# Altium schematic sheet STM32_MCU.SchDoc
size A3; SheetNumber: 7; SheetTotal: 16
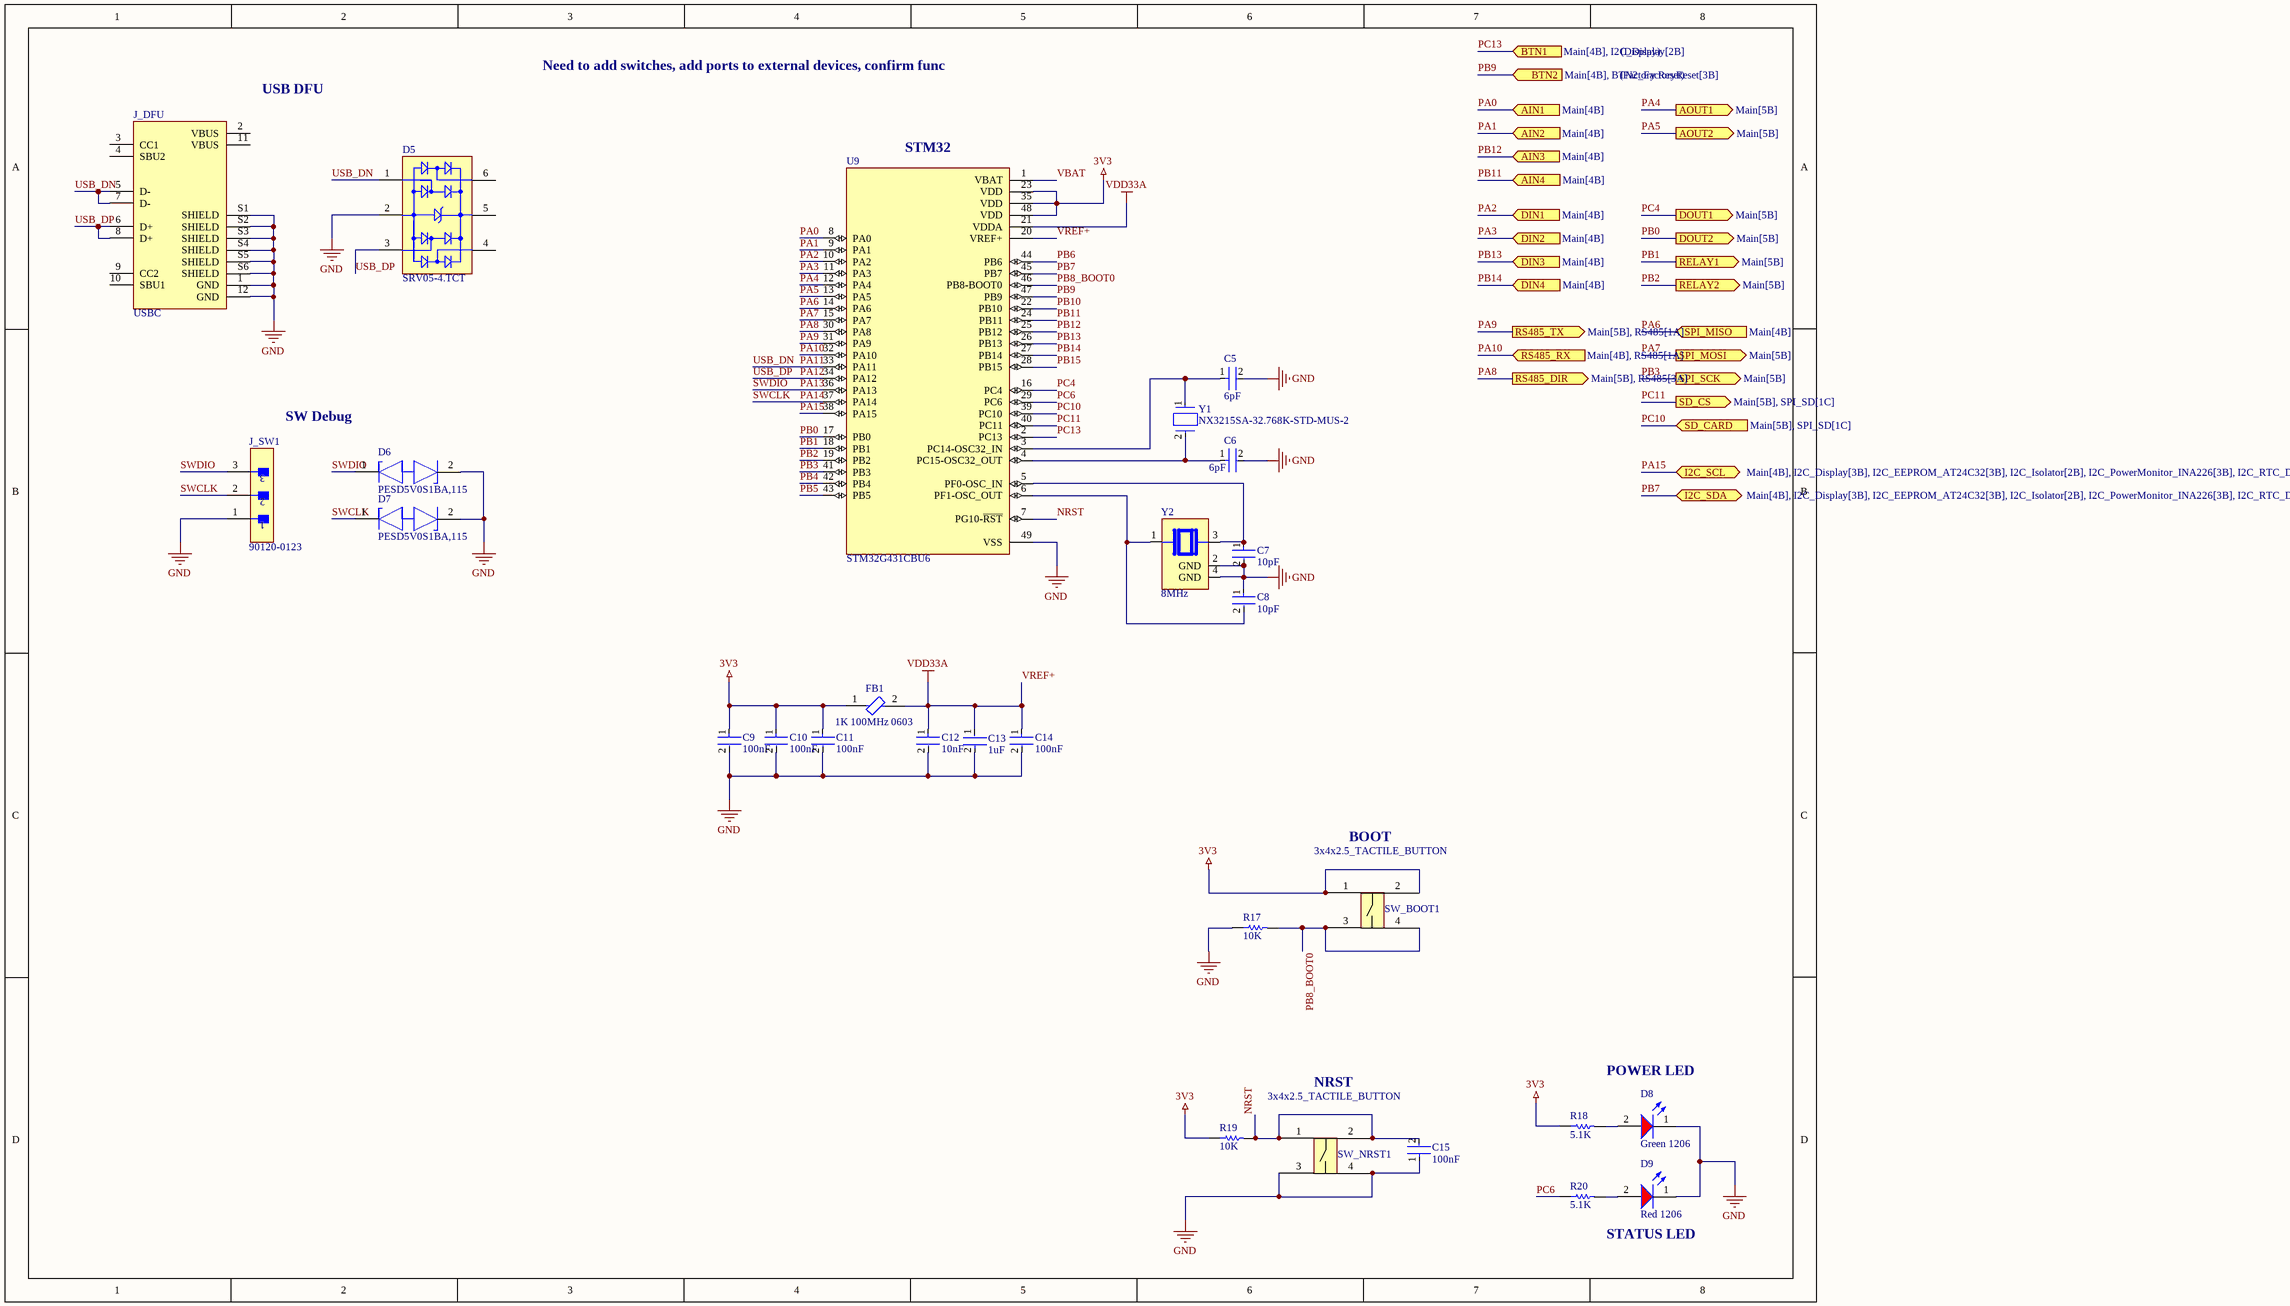
[diagram p0: STM32_MCU.SchDoc]

## Parts
C5  6pF  [FP-CGA3E-0_3-0_1-MFG]
C6  6pF  [FP-CGA3E-0_3-0_1-MFG]
C7  10pF  [FP-C0603C-CF-MFG]
C8  10pF  [FP-C0603C-CF-MFG]
C9  100nF  [FP-CGA3E-0_3-0_1-IPC_A]
C10  100nF  [FP-CGA3E-0_3-0_1-IPC_A]
C11  100nF  [FP-CGA3E-0_3-0_1-IPC_A]
C12  10nF  [FP-CC0603-DA-MFG]
C13  1uF  [FP-C1608-080-0_1-IPC_B]
C14  100nF  [FP-CGA3E-0_3-0_1-IPC_A]
C15  100nF  [FP-CGA3E-0_3-0_1-IPC_A]
D5  SRV05-4.TCT  [SMTC-SOT23-6_V]
D6  PESD5V0S1BA,115  [FP-SOD323-CA-MFG]
D7  PESD5V0S1BA,115  [FP-SOD323-CA-MFG]
D8  Green 1206  [WL-SMCW_1206_150120xx75000]
D9  Red 1206  [WL-SMCW_1206_150120xx75000]
FB1  1K 100MHz 0603  [FP-BLM18-0_15-t0_8-MFG]
J_DFU  USBC  [JAE_DX07S016JA1R1500]
J_SW1  90120-0123  [FP-90120-0123-MFG]
R17  10K  [RESC1609X55X30LL15T15]
R18  5.1K  [RESC1608X55X30LL15T15]
R19  10K  [RESC1609X55X30LL15T15]
R20  5.1K  [RESC1608X55X30LL15T15]
SW_BOOT1  3x4x2.5_TACTILE_BUTTON  [3x4x2.5_TACTILE_BUTTON]
SW_NRST1  3x4x2.5_TACTILE_BUTTON  [3x4x2.5_TACTILE_BUTTON]
U9  STM32G431CBU6  [QFN50P700X700X60-49N]
Y1  NX3215SA-32.768K-STD-MUS-2  [FP-NX3215SA-MFG]
Y2  8MHz  [XTAL_C3E-8.000-10-1020-M]

## Ports
AIN1 (in, see Main[4B]), AIN2 (in, see Main[4B]), AIN3 (in, see Main[4B]), AIN4 (in, see Main[4B]), AOUT1 (out, see Main[5B]), AOUT2 (out, see Main[5B]), BTN1 (in, see Main[4B], I2C_Display[2B]), BTN2 (in, see Main[4B], BTN2_FactoryReset[3B]), DIN1 (in, see Main[4B]), DIN2 (in, see Main[4B]), DIN3 (in, see Main[4B]), DIN4 (in, see Main[4B]), DOUT1 (out, see Main[5B]), DOUT2 (out, see Main[5B]), I2C_SCL (bidir, see Main[4B], I2C_Display[3B], I2C_EEPROM_AT24C32[3B], I2C_Isolator[2B], I2C_PowerMonitor_INA226[3B], I2C_RTC_DS3231[2B]), I2C_SDA (bidir, see Main[4B], I2C_Display[3B], I2C_EEPROM_AT24C32[3B], I2C_Isolator[2B], I2C_PowerMonitor_INA226[3B], I2C_RTC_DS3231[2B]), RELAY1 (out, see Main[5B]), RELAY2 (out, see Main[5B]), RS485_DIR (out, see Main[5B], RS485[3A]), RS485_RX (in, see Main[4B], RS485[1A]), RS485_TX (out, see Main[5B], RS485[1A]), SD_CARD (in, see Main[5B], SPI_SD[1C]), SD_CS (out, see Main[5B], SPI_SD[1C]), SPI_MISO (in, see Main[4B]), SPI_MOSI (out, see Main[5B]), SPI_SCK (out, see Main[5B])

## Nets
3V3: C9.1 C10.1 C11.1 FB1.1 R18.1 R19.1 SW_BOOT1.1 SW_BOOT1.2 U9.23(VDD) U9.35(VDD) U9.48(VDD)
GND: C5.2 C6.2 C7.2 C8.1 C9.2 C10.2 C11.2 C12.2 C13.2 C14.2 C15.1 D5.2(GND) D6.2(K2) D7.2(K2) D8.1(K) D9.1(K) J_DFU.1(GND) J_DFU.12(GND) J_DFU.S1(SHIELD) J_DFU.S2(SHIELD) J_DFU.S3(SHIELD) J_DFU.S4(SHIELD) J_DFU.S5(SHIELD) J_DFU.S6(SHIELD) J_SW1.1 R17.1 SW_NRST1.3 SW_NRST1.4 U9.49(VSS) Y2.2(GND) Y2.4(GND)
VREF+: C12.1 C13.1 C14.1 FB1.2 U9.20(VREF+) U9.21(VDDA)  [also labelled VDD33A]
NRST: C15.2 R19.2 SW_NRST1.1 SW_NRST1.2 U9.7(PG10-~{RST})
PA0: U9.8(PA0) ; port AIN1
PA1: U9.9(PA1) ; port AIN2
PA2: U9.10(PA2) ; port DIN1
PA3: U9.11(PA3) ; port DIN2
PA4: U9.12(PA4) ; port AOUT1
PA5: U9.13(PA5) ; port AOUT2
PA6: U9.14(PA6) ; port SPI_MISO
PA7: U9.15(PA7) ; port SPI_MOSI
PA8: U9.30(PA8) ; port RS485_DIR
PA9: U9.31(PA9) ; port RS485_TX
PA10: U9.32(PA10) ; port RS485_RX
PA11: D5.1(I/O_1) J_DFU.5(D-) J_DFU.7(D-) U9.33(PA11)  [also labelled USB_DN]
PA12: D5.3(I/O_2) J_DFU.6(D+) J_DFU.8(D+) U9.34(PA12)  [also labelled USB_DP]
PA13: D6.1(K1) J_SW1.3 U9.36(PA13)  [also labelled SWDIO]
PA14: D7.1(K1) J_SW1.2 U9.37(PA14)  [also labelled SWCLK]
PA15: U9.38(PA15) ; port I2C_SCL
PB0: U9.17(PB0) ; port DOUT2
PB1: U9.18(PB1) ; port RELAY1
PB2: U9.19(PB2) ; port RELAY2
PB3: U9.41(PB3) ; port SPI_SCK
PB4: U9.42(PB4)
PB5: U9.43(PB5)
PB6: U9.44(PB6)
PB7: U9.45(PB7) ; port I2C_SDA
PB8_BOOT0: R17.2 SW_BOOT1.3 SW_BOOT1.4 U9.46(PB8-BOOT0)
PB9: U9.47(PB9) ; port BTN2
PB10: U9.22(PB10)
PB11: U9.24(PB11) ; port AIN4
PB12: U9.25(PB12) ; port AIN3
PB13: U9.26(PB13) ; port DIN3
PB14: U9.27(PB14) ; port DIN4
PB15: U9.28(PB15)
PC4: U9.16(PC4) ; port DOUT1
PC6: R20.1 U9.29(PC6)
PC10: U9.39(PC10) ; port SD_CARD
PC11: U9.40(PC11) ; port SD_CS
PC13: U9.2(PC13) ; port BTN1
VBAT: U9.1(VBAT)
NetC5_1: C5.1 U9.3(PC14-OSC32_IN) Y1.1
NetC6_1: C6.1 U9.4(PC15-OSC32_OUT) Y1.2
NetC7_1: C7.1 U9.5(PF0-OSC_IN) Y2.3
NetC8_2: C8.2 U9.6(PF1-OSC_OUT) Y2.1
NetD8_2: D8.2(A) R18.2
NetD9_2: D9.2(A) R20.2

Not connected (* = marked no-connect by the designer): D5 4(I/O_3) 5(VBUS) 6(I/O_4); J_DFU 2(VBUS) 3(CC1) 4(SBU2) 9(CC2) 10(SBU1) 11(VBUS)

## Notes on the sheet
- USB DFU
- Need to add switches, add ports to external devices, confirm func
- (Display)
- (Factory Reset)
- (near U9) STM32
- SW Debug
- BOOT
- NRST
- POWER LED
- STATUS LED

## Library data of the parts
C5 C6 = CMP-08246-001317-1: Cap Ceramic 6pF 50V C0G 0.5pF Pad SMD 0603 +125°C Automotive T/R; Weight: 7.1E-05oz; Capacitance: 6pF; Min Operating Temperature: -55°C; Termination: SMD/SMT; Mount: Surface Mount; Thickness: 0.035inch; Voltage Rating: 50V; Case Code (Metric): 1608; Package Quantity: 1; Length: 1.6mm; Dielectric: C0G; REACH SVHC: No SVHC; Packaging: Tape and Reel; Height: 0.8mm; Composition: Ceramic; Depth: 0.8mm; Case Code (Imperial): 0603; Case/Package: 0603; Max Operating Temperature: 125°C; Voltage Rating (DC): 50V; Ratings: AEC-Q200; Width: 0.031inch
C7 C8 = CMP-2006-03343-2: CAP CER 10PF 50V NP0 0603; Manufacturer: KEMET; Manufacturer Part Number: C0603C100C5GACTU; Material: Ceramic; Temperature Coefficient: 30ppm/°C; Automotive Grade: Grade 1; Tolerance: 0.25 pF; Temperature Characteristic: C0G; Device Class L3: Ceramic Capacitors; Value: 10 pF; Device Class L1: Passive Components; Lead Free: Yes; RoHS: TRUE; Voltage Rating: 50 V; Automotive: Yes; Capacitance: 10 pF; Height: 0.87mm; Temperature Range Low: -55°C; Temperature Range High: +125°C; Mouser Description: Multilayer Ceramic Capacitors MLCC - SMD/SMT 50volts 10pF C0G 0.25%; Device Class L2: Capacitors; Digikey Description: CAP CER 10PF 50V NP0 0603; ComponentLink2Description: Datasheet; Package: C0603C-CF; ComponentLink2URL: https://api.kemet.com/component-edge/download/datasheet/C0603C100J5GACAUTO.pdf; Category: Cap; Octopart: https://octopart.com/c0603c100c5gactu-kemet-9138556; Temperature: -55°C to +125°C
C9-C11 C14 C15 = CMP-2000-07546-2: Cap Ceramic 100nF 50V X7R 10% Pad SMD 0603 +125°C Automotive T/R; Weight: 7.1E-05oz; Composition: Ceramic; Max Operating Temperature: 125°C; Termination: SMD/SMT; Dielectric: X7R; Length: 1.6mm; Package Quantity: 1; REACH SVHC: No SVHC; Lead Free: Lead Free; Case Code (Metric): 1608; Min Operating Temperature: -55°C; Packaging: Tape and Reel; Tolerance: 10%; Voltage Rating: 50V; Case Code (Imperial): 0603; Capacitance: 100nF; Case/Package: 0603; Voltage Rating (DC): 50V; Depth: 0.8mm; Radiation Hardening: No; Ratings: AEC-Q200; Mount: Surface Mount; Voltage: 50V; Thickness: 0.035inch; Width: 0.8mm; Height: 0.8mm
C12 = CMP-2100-03600-2: CAP CER 10000PF 50V X7R 0603; Manufacturer Part Number: CC0603KRX7R9BB103; Manufacturer: YAGEO; Tolerance: 0.1; Material: Ceramic; Temperature Coefficient: 15%; Mouser Description: Multilayer Ceramic Capacitor, CC Series, 0.01 - F, - 10%, X7R, 50 V, 0603 [1608 Metric]; Digikey Description: CAP CER 10000PF 50V X7R 0603; Height: 0.9mm; Category: Cap; Temperature Characteristic: X7R; Footprint Url: http://www.yageo.com/exep/pages/download/literatures/UPY-C_GEN_24.pdf; Lead Free: Yes; Voltage Rating: 50 V; Temperature: -55°C to +125°C; Device Class L3: Ceramic Capacitors; ComponentLink2Description: Datasheet; Voltage: 50 V; Package: CC0603-DA; Octopart: https://octopart.com/cc0603krx7r9bb103-yageo-192938; Automotive: No; Temperature Range High: +125°C; Temperature Range Low: -55°C; Value: 10 nF; RoHS: TRUE; Device Class L1: Passive Components; ComponentLink2URL: http://www.yageo.com/documents/recent/UPY-GPHC_X7R_6.3V-to-50V_18.pdf; Device Class L2: Capacitors; Capacitance: 10 nF
C13 = CMP-2000-06025-2: Multilayer Ceramic Capacitors 1μF ±10% 50V X5R SMD 0603; Lead Free: Lead Free; Height: 0.8mm; Mount: Surface Mount; Radiation Hardening: No; Thickness: 0.035inch; Length: 1.6mm; Max Operating Temperature: 85°C; REACH SVHC: No SVHC; Min Operating Temperature: -55°C; Construction: Flat; RoHS Compliant: Yes; Voltage Rating: 50V; Dielectric: X5R; Packaging: Tape and Reel; Termination: SMD/SMT; Voltage Rating (DC): 50V; Case Code (Imperial): 0603; Voltage: 50V; Width: 0.031inch; Weight: 7.1E-05oz; Capacitance: 1uF; Depth: 0.8mm; Case Code (Metric): 1608; Series: C; Case/Package: 0603; Tolerance: 10%; Resistor Type: Ceramic; Number of Pins: 2; Dielectric Material: Ceramic; Package Quantity: 1
D5 = CMP-2000-05358-1: RailClamp(R) Low Capacitance TVS Diode Array, 5 pF, 17.5 VC, -55 to 125 degC, 6-Pin SOT23, RoHS, Tape and Reel; Manufacturer: Semtech; Leakage Current (Max): 5uA; Polarity: Uni-Directional; Peak Pulse Power Dissipation: 300W; Clamping Voltage: 17.5V; Number of Elements: 1; Working Voltage: 5V; Test Current (It): 1mA; Configuration: Quad; Reverse Breakdown Voltage: 6V; Suppressor Type: DiodeArrays; Peak Pulse Current: 12A; Product Depth (mm): 1.6mm; Product Height (mm): 1.15mm; Clamping Voltage (Max): 12.5V; Rad Hardened: No; Product Length (mm): 2.9mm; Capacitance Value: 5pF; Mounting: SurfaceMount; Datasheet URL: https://datasheet.ciiva.com/8029/srv05-4-8029973.pdf; Datasheet Version: Jan-08; Packaging: TapeandReel; Package / Case: SOT-23; Operating Temp Range: -55Cto125C; Pin Count: 6; Direction Type: Uni-Directional; Operating Temperature Min Deg. C: -55C; Reverse Stand-off Voltage: 5V; Leakage Current: 5uA; Manufacturer URL: http://www.semtech.com/; Working Voltage (Max): 5V; Package Reference: SOT23-6; Package Description: 6-Pin Small Outline Transistor, Body 2.9 x 1.6 mm, Pitch 0.95 mm; Operating Temperature Max Deg. C: 125C; Operating Temperature Classification: Military; Mounting Style: SurfaceMount
D6 D7 = CMP-14432-000001-1: TVS DIODE 5V 14V SOD323
D8 D9 = CMP-1426-00017-3: Led, Red, 630 Nm, 1.9 V, 30 Ma, 60 Mcd Rohs Compliant: Yes; Forward Current: 100mA; Max Reverse Voltage (DC): 5V; Lens Style: Clear, Rectangular; Viewing Angle: 140°; Luminous Intensity: 60mcd; Peak Wavelength: 645nm; Forward Voltage: 1.9V; Test Current: 20mA; Dominant Wavelength: 630nm; Case Code (Imperial): 1206; Length: 3.2mm; Mount: Surface Mount; Case Code (Metric): 3216; Case/Package: 1206; Min Operating Temperature: -40°C; Width: 1.6mm; Color: Red; Height: 680µm; REACH SVHC: Unknown; Max Operating Temperature: 85°C; Wavelength: 630nm; RoHS: Compliant; Packaging: Tape and Reel
FB1 = CMP-0686-00457-3: Chip Ferrite Bead, 0603, 1000Ω @ 100MHz, 0.5Ω, 25%, 450mA; Number of Circuits: 1; Max DC Current: 400mA; Shielding: Unshielded; DC Resistance (DCR): 500mR; Material: Steel; DC Resistance-Max: 700mR; Impedance: 1kR; Case Code (Imperial): 0603; Max Current Rating: 400mA; Frequency: 100MHz; Min Operating Temperature: -55°C; Case/Package: 0603; Depth: 0.8mm; Lead Free: Lead Free; Core Material: Ferrite; Current Rating: 400mA; Resistance: 500mR; Case Code (Metric): 1608; DC Current: 400mA; Package Quantity: 1; Packaging: Tape and Reel; Width: 0.8mm; Military Standard: Not; Height: 0.8mm; Series: BLM18A; Max Operating Temperature: 125°C; Tolerance: 25%; Termination: SMD/SMT; Test Frequency: 100MHz; Number of Lines: 1; Number of Pins: 2; REACH SVHC: No SVHC; Length: 1.6mm; Radiation Hardening: No
J_DFU = DX07S016JA1R1500: USB-C (USB TYPE-C) USB 2.0 Receptacle Connector 24 (16+8 Dummy) Position Surface Mount, Right Angle; Through Hole; Package: None; Value: *; Price: None; MP: DX07S016JA1R1500; Availability: Unavailable
J_SW1 = CMP-04776-000237-1: CONN HEADER VERT 3POS 2.54MM; Number of Circuits: 3; Max Voltage Rating (DC): 350.35kV; Contact Resistance: 20mR; Gender: Male; Voltage Rating (AC): 350V; Glow Wire Compliant: Non-compliant; Current Rating: 3A; Contact Post Length: 2.9mm; Number of Contacts: 3; Number of Rows: 1; Max Operating Temperature: 125°C; Orientation: Vertical; Number of Positions: 3; Packaging: Tray; Contact Mating Length: 6.75mm; Housing Color: Black; Termination: Solder; Contact Material: Brass; Radiation Hardening: No; Lead Free: Lead Free; Pitch: 2.54mm; RoHS Compliant: Yes; Voltage Rating: 350V; Contact Plating: Tin; Color: Black; Min Operating Temperature: -55°C; Mount: Through Hole; Housing Material: Polyester; Series: 90120; Contact Gender: Male; REACH SVHC: No SVHC
R17 R19 = CMP-1012-00623-3: Chip Resistor, 10 KOhm, +/- 1%, 0.1 W, -55 to 155 degC, 0603 (1608 Metric), RoHS, Tape and Reel; Manufacturer: Panasonic; Voltage Rating: 75V; Case\/Package: 0603; Power Rating: 100mW; Resistance: 10KOhm; Temperature Coefficient: 100ppm\/degreesC; Number of Pins: 2; Package Reference: 603; Depth: 0.8mm; Mount: SurfaceMount; Package Description: 2-Pin Surface Mount Device, Body 1.6 x 0.85 mm; Datasheet Version: 02/2017; Length: 1.6mm; Lead Free: LeadFree; Height: 0.45mm; Number of Terminations: 2; Max Power Dissipation: 100mW; Min Operating Temperature: -55degC; Datasheet URL: https://industrial.panasonic.com/cdbs/www-data/pdf/RDA0000/AOA0000C304.pdf; Termination: SMD/SMT; Case Code (Metric): 1608; Case Code (Imperial): 0603; Tolerance: 1%; Max Operating Temperature: 155degC; RoHSCompliant: true; Voltage Rating (DC): 75V; Radiation Hardening: No; Packaging: TapeandReel; Composition: ThickFilm; Mounting Technology: SurfaceMount; Manufacturer URL: http://www.panasonic.com/; Width: 0.031inch; REACH SVHC: NoSVHC; Contact Plating: Tin; Military Standard: Not; Package Quantity: 1
R18 R20 = CMP-2000-00803-1: Part Number: ERJ-3GEYJ512V; Manufacturer: Panasonic
U9 = STM32G431CBU6: ARMÂ® CortexÂ®-M4F STM32G4 Microcontroller IC 32-Bit Single-Core 170MHz 128KB (128K x 8) FLASH 48-UFQFPN (7x7); MF: STMicroelectronics; SnapEDA_Link: https://www.snapeda.com/parts/STM32G431CBU6/STMicroelectronics/view-part/?ref=snap; Package: UFQFPN-48 STMicroelectronics; Value: *; MP: STM32G431CBU6; Check_prices: https://www.snapeda.com/parts/STM32G431CBU6/STMicroelectronics/view-part/?ref=eda
Y1 = CMP-200220-000010-1: CRYSTAL 32.7680KHZ 12.5PF SMD; Frequency Tolerance: 20ppm; ESR (Equivalent Series Resistance): 70kR; Frequency: 32.768kHz; Length: 0.126inch; Number of Pins: 2; Max Operating Temperature: 125°C; Width: 0.059inch; Load Capacitance: 12.5pF; Case/Package: SMD/SMT; Height: 0.035inch; Packaging: Tape and Reel; Mount: Surface Mount; Package Quantity: 1000; Min Operating Temperature: -40°C
Y2 = C3E-8.000-10-1020-M: Package: None; Price: None; Value: *; MP: C3E-8.000-10-1020-M; Availability: Unavailable